# EAGLE design lamloei_breadout_a07201 (EAGLE 7.7.0)
CNAME: LamLoei breadout A07201; CREVISION: R1; DESIGNER: lamloei co.,ltd.
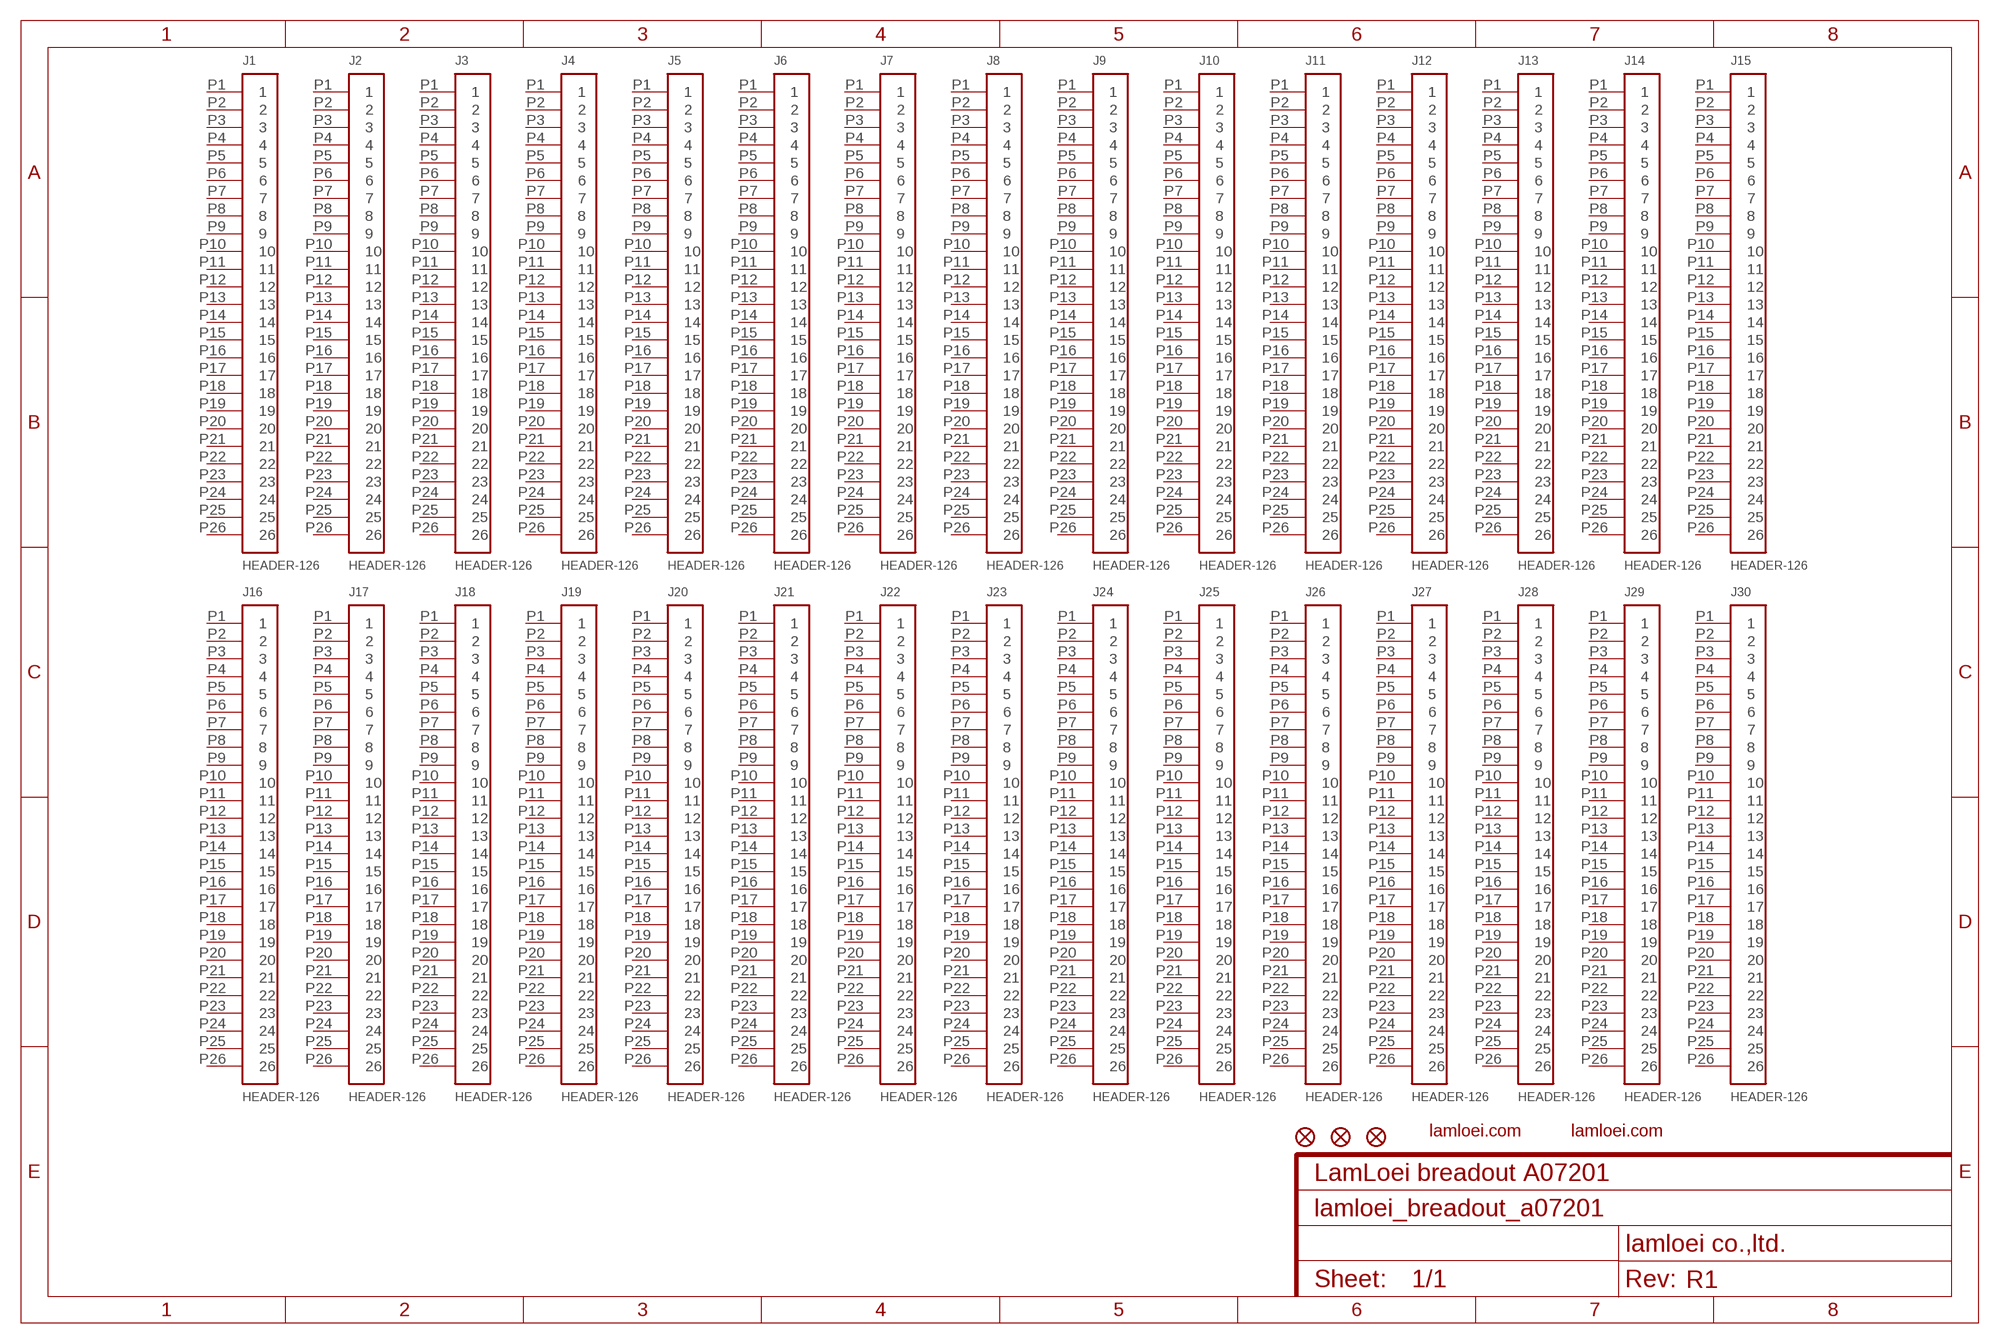
[diagram p0: schematic, sheet 1]

## Parts
J1  HEADER-126  [HEADER-126]
J2  HEADER-126  [HEADER-126]
J3  HEADER-126  [HEADER-126]
J4  HEADER-126  [HEADER-126]
J5  HEADER-126  [HEADER-126]
J6  HEADER-126  [HEADER-126]
J7  HEADER-126  [HEADER-126]
J8  HEADER-126  [HEADER-126]
J9  HEADER-126  [HEADER-126]
J10  HEADER-126  [HEADER-126]
J11  HEADER-126  [HEADER-126]
J12  HEADER-126  [HEADER-126]
J13  HEADER-126  [HEADER-126]
J14  HEADER-126  [HEADER-126]
J15  HEADER-126  [HEADER-126]
J16  HEADER-126  [HEADER-126]
J17  HEADER-126  [HEADER-126]
J18  HEADER-126  [HEADER-126]
J19  HEADER-126  [HEADER-126]
J20  HEADER-126  [HEADER-126]
J21  HEADER-126  [HEADER-126]
J22  HEADER-126  [HEADER-126]
J23  HEADER-126  [HEADER-126]
J24  HEADER-126  [HEADER-126]
J25  HEADER-126  [HEADER-126]
J26  HEADER-126  [HEADER-126]
J27  HEADER-126  [HEADER-126]
J28  HEADER-126  [HEADER-126]
J29  HEADER-126  [HEADER-126]
J30  HEADER-126  [HEADER-126]
ZFD1  FIDUCIAL1X2  [FIDUCIAL-1X2]
ZFD2  FIDUCIAL1X2  [FIDUCIAL-1X2]
ZFD3  FIDUCIAL1X2  [FIDUCIAL-1X2]
ZL1  LAMLEOI_LOGO_3  [LAMLEOI_LOGO_3]
ZL2  LAMLEOI_LOGO_3  [LAMLEOI_LOGO_3]
Unconnected: J1.P1 J1.P2 J1.P3 J1.P4 J1.P5 J1.P6 J1.P7 J1.P8 J1.P9 J1.P10 J1.P11 J1.P12 J1.P13 J1.P14 J1.P15 J1.P16 J1.P17 J1.P18 J1.P19 J1.P20 J1.P21 J1.P22 J1.P23 J1.P24 J1.P25 J1.P26 J2.P1 J2.P2 J2.P3 J2.P4 J2.P5 J2.P6 J2.P7 J2.P8 J2.P9 J2.P10 J2.P11 J2.P12 J2.P13 J2.P14 J2.P15 J2.P16 J2.P17 J2.P18 J2.P19 J2.P20 J2.P21 J2.P22 J2.P23 J2.P24 J2.P25 J2.P26 J3.P1 J3.P2 J3.P3 J3.P4 J3.P5 J3.P6 J3.P7 J3.P8 J3.P9 J3.P10 J3.P11 J3.P12 J3.P13 J3.P14 J3.P15 J3.P16 J3.P17 J3.P18 J3.P19 J3.P20 J3.P21 J3.P22 J3.P23 J3.P24 J3.P25 J3.P26 J4.P1 J4.P2 J4.P3 J4.P4 J4.P5 J4.P6 J4.P7 J4.P8 J4.P9 J4.P10 J4.P11 J4.P12 J4.P13 J4.P14 J4.P15 J4.P16 J4.P17 J4.P18 J4.P19 J4.P20 J4.P21 J4.P22 J4.P23 J4.P24 J4.P25 J4.P26 J5.P1 J5.P2 J5.P3 J5.P4 J5.P5 J5.P6 J5.P7 J5.P8 J5.P9 J5.P10 J5.P11 J5.P12 J5.P13 J5.P14 J5.P15 J5.P16 J5.P17 J5.P18 J5.P19 J5.P20 J5.P21 J5.P22 J5.P23 J5.P24 J5.P25 J5.P26 J6.P1 J6.P2 J6.P3 J6.P4 J6.P5 J6.P6 J6.P7 J6.P8 J6.P9 J6.P10 J6.P11 J6.P12 J6.P13 J6.P14 J6.P15 J6.P16 J6.P17 J6.P18 J6.P19 J6.P20 J6.P21 J6.P22 J6.P23 J6.P24 J6.P25 J6.P26 J7.P1 J7.P2 J7.P3 J7.P4 J7.P5 J7.P6 J7.P7 J7.P8 J7.P9 J7.P10 J7.P11 J7.P12 J7.P13 J7.P14 J7.P15 J7.P16 J7.P17 J7.P18 J7.P19 J7.P20 J7.P21 J7.P22 J7.P23 J7.P24 J7.P25 J7.P26 J8.P1 J8.P2 J8.P3 J8.P4 J8.P5 J8.P6 J8.P7 J8.P8 J8.P9 J8.P10 J8.P11 J8.P12 J8.P13 J8.P14 J8.P15 J8.P16 J8.P17 J8.P18 J8.P19 J8.P20 J8.P21 J8.P22 J8.P23 J8.P24 J8.P25 J8.P26 J9.P1 J9.P2 J9.P3 J9.P4 J9.P5 J9.P6 J9.P7 J9.P8 J9.P9 J9.P10 J9.P11 J9.P12 J9.P13 J9.P14 J9.P15 J9.P16 J9.P17 J9.P18 J9.P19 J9.P20 J9.P21 J9.P22 J9.P23 J9.P24 J9.P25 J9.P26 J10.P1 J10.P2 J10.P3 J10.P4 J10.P5 J10.P6 J10.P7 J10.P8 J10.P9 J10.P10 J10.P11 J10.P12 J10.P13 J10.P14 J10.P15 J10.P16 J10.P17 J10.P18 J10.P19 J10.P20 J10.P21 J10.P22 J10.P23 J10.P24 J10.P25 J10.P26 J11.P1 J11.P2 J11.P3 J11.P4 J11.P5 J11.P6 J11.P7 J11.P8 J11.P9 J11.P10 J11.P11 J11.P12 J11.P13 J11.P14 J11.P15 J11.P16 J11.P17 J11.P18 J11.P19 J11.P20 J11.P21 J11.P22 J11.P23 J11.P24 J11.P25 J11.P26 J12.P1 J12.P2 J12.P3 J12.P4 J12.P5 J12.P6 J12.P7 J12.P8 J12.P9 J12.P10 J12.P11 J12.P12 J12.P13 J12.P14 J12.P15 J12.P16 J12.P17 J12.P18 J12.P19 J12.P20 J12.P21 J12.P22 J12.P23 J12.P24 J12.P25 J12.P26 J13.P1 J13.P2 J13.P3 J13.P4 J13.P5 J13.P6 J13.P7 J13.P8 J13.P9 J13.P10 J13.P11 J13.P12 J13.P13 J13.P14 J13.P15 J13.P16 J13.P17 J13.P18 J13.P19 J13.P20 J13.P21 J13.P22 J13.P23 J13.P24 J13.P25 J13.P26 J14.P1 J14.P2 J14.P3 J14.P4 J14.P5 J14.P6 J14.P7 J14.P8 J14.P9 J14.P10 J14.P11 J14.P12 J14.P13 J14.P14 J14.P15 J14.P16 J14.P17 J14.P18 J14.P19 J14.P20 J14.P21 J14.P22 J14.P23 J14.P24 J14.P25 J14.P26 J15.P1 J15.P2 J15.P3 J15.P4 J15.P5 J15.P6 J15.P7 J15.P8 J15.P9 J15.P10 J15.P11 J15.P12 J15.P13 J15.P14 J15.P15 J15.P16 J15.P17 J15.P18 J15.P19 J15.P20 J15.P21 J15.P22 J15.P23 J15.P24 J15.P25 J15.P26 J16.P1 J16.P2 J16.P3 J16.P4 J16.P5 J16.P6 J16.P7 J16.P8 J16.P9 J16.P10 J16.P11 J16.P12 J16.P13 J16.P14 J16.P15 J16.P16 J16.P17 J16.P18 J16.P19 J16.P20 J16.P21 J16.P22 J16.P23 J16.P24 J16.P25 J16.P26 J17.P1 J17.P2 J17.P3 J17.P4 J17.P5 J17.P6 J17.P7 J17.P8 J17.P9 J17.P10 J17.P11 J17.P12 J17.P13 J17.P14 J17.P15 J17.P16 J17.P17 J17.P18 J17.P19 J17.P20 J17.P21 J17.P22 J17.P23 J17.P24 J17.P25 J17.P26 J18.P1 J18.P2 J18.P3 J18.P4 J18.P5 J18.P6 J18.P7 J18.P8 J18.P9 J18.P10 J18.P11 J18.P12 J18.P13 J18.P14 J18.P15 J18.P16 J18.P17 J18.P18 J18.P19 J18.P20 J18.P21 J18.P22 J18.P23 J18.P24 J18.P25 J18.P26 J19.P1 J19.P2 J19.P3 J19.P4 J19.P5 J19.P6 J19.P7 J19.P8 J19.P9 J19.P10 J19.P11 J19.P12 J19.P13 J19.P14 J19.P15 J19.P16 J19.P17 J19.P18 J19.P19 J19.P20 J19.P21 J19.P22 J19.P23 J19.P24 J19.P25 J19.P26 J20.P1 J20.P2 J20.P3 J20.P4 J20.P5 J20.P6 J20.P7 J20.P8 J20.P9 J20.P10 J20.P11 J20.P12 J20.P13 J20.P14 J20.P15 J20.P16 J20.P17 J20.P18 J20.P19 J20.P20 J20.P21 J20.P22 J20.P23 J20.P24 J20.P25 J20.P26 J21.P1 J21.P2 J21.P3 J21.P4 J21.P5 J21.P6 J21.P7 J21.P8 J21.P9 J21.P10 J21.P11 J21.P12 J21.P13 J21.P14 J21.P15 J21.P16 J21.P17 J21.P18 J21.P19 J21.P20 J21.P21 J21.P22 J21.P23 J21.P24 J21.P25 J21.P26 J22.P1 J22.P2 J22.P3 J22.P4 J22.P5 J22.P6 J22.P7 J22.P8 J22.P9 J22.P10 J22.P11 J22.P12 J22.P13 J22.P14 J22.P15 J22.P16 J22.P17 J22.P18 J22.P19 J22.P20 J22.P21 J22.P22 J22.P23 J22.P24 J22.P25 J22.P26 J23.P1 J23.P2 J23.P3 J23.P4 J23.P5 J23.P6 J23.P7 J23.P8 J23.P9 J23.P10 J23.P11 J23.P12 J23.P13 J23.P14 J23.P15 J23.P16 J23.P17 J23.P18 J23.P19 J23.P20 J23.P21 J23.P22 J23.P23 J23.P24 J23.P25 J23.P26 J24.P1 J24.P2 J24.P3 J24.P4 J24.P5 J24.P6 J24.P7 J24.P8 J24.P9 J24.P10 J24.P11 J24.P12 J24.P13 J24.P14 J24.P15 J24.P16 J24.P17 J24.P18 J24.P19 J24.P20 J24.P21 J24.P22 J24.P23 J24.P24 J24.P25 J24.P26 J25.P1 J25.P2 J25.P3 J25.P4 J25.P5 J25.P6 J25.P7 J25.P8 J25.P9 J25.P10 J25.P11 J25.P12 J25.P13 J25.P14 J25.P15 J25.P16 J25.P17 J25.P18 J25.P19 J25.P20 J25.P21 J25.P22 J25.P23 J25.P24 J25.P25 J25.P26 J26.P1 J26.P2 J26.P3 J26.P4 J26.P5 J26.P6 J26.P7 J26.P8 J26.P9 J26.P10 J26.P11 J26.P12 J26.P13 J26.P14 J26.P15 J26.P16 J26.P17 J26.P18 J26.P19 J26.P20 J26.P21 J26.P22 J26.P23 J26.P24 J26.P25 J26.P26 J27.P1 J27.P2 J27.P3 J27.P4 J27.P5 J27.P6 J27.P7 J27.P8 J27.P9 J27.P10 J27.P11 J27.P12 J27.P13 J27.P14 J27.P15 J27.P16 J27.P17 J27.P18 J27.P19 J27.P20 J27.P21 J27.P22 J27.P23 J27.P24 J27.P25 J27.P26 J28.P1 J28.P2 J28.P3 J28.P4 J28.P5 J28.P6 J28.P7 J28.P8 J28.P9 J28.P10 J28.P11 J28.P12 J28.P13 J28.P14 J28.P15 J28.P16 J28.P17 J28.P18 J28.P19 J28.P20 J28.P21 J28.P22 J28.P23 J28.P24 J28.P25 J28.P26 J29.P1 J29.P2 J29.P3 J29.P4 J29.P5 J29.P6 J29.P7 J29.P8 J29.P9 J29.P10 J29.P11 J29.P12 J29.P13 J29.P14 J29.P15 J29.P16 J29.P17 J29.P18 J29.P19 J29.P20 J29.P21 J29.P22 J29.P23 J29.P24 J29.P25 J29.P26 J30.P1 J30.P2 J30.P3 J30.P4 J30.P5 J30.P6 J30.P7 J30.P8 J30.P9 J30.P10 J30.P11 J30.P12 J30.P13 J30.P14 J30.P15 J30.P16 J30.P17 J30.P18 J30.P19 J30.P20 J30.P21 J30.P22 J30.P23 J30.P24 J30.P25 J30.P26

## Library data of the parts
J1-J30 = lamloei_e77_HEADER-126B:HEADER-126
ZFD1-ZFD3 = SparkFun-Aesthetics:FIDUCIAL: Fiducial Alignment Points Point-of-reference for pick-and-place machines and other optical instruments.
ZL1 ZL2 = lamloei_logo_3:LAMLEOI_LOGO_3: lamloei

## Board
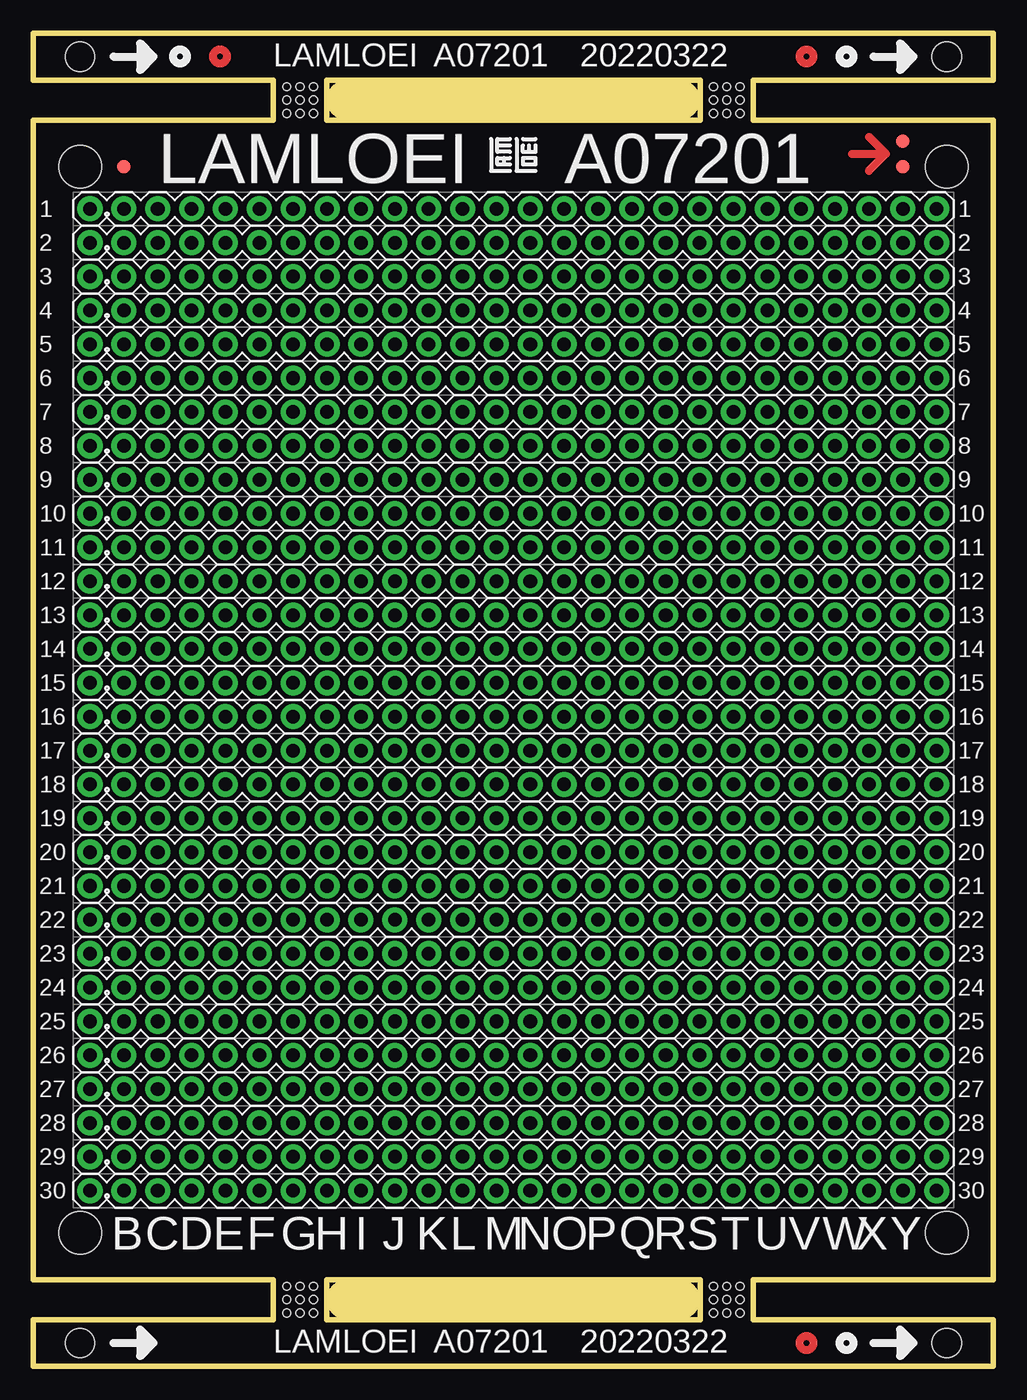
[diagram p1: board, top side]
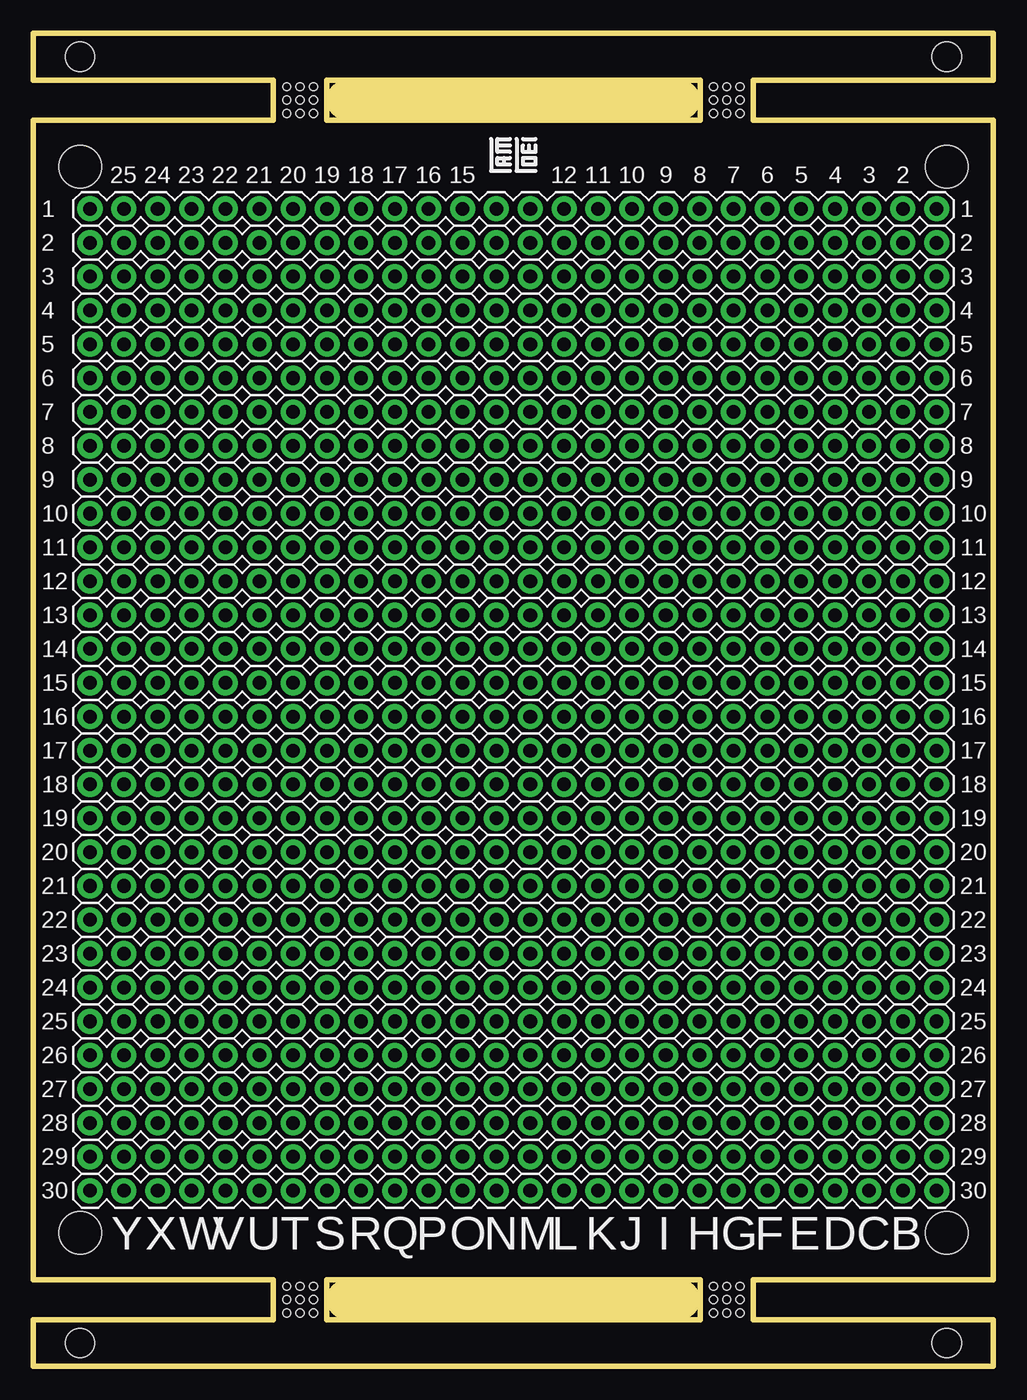
[diagram p2: board, bottom side, seen from below]

Size 72 x 100 mm. Coordinates in mm from the lower left corner, seen from the top.
Outline: 0,93.5 18,93.5 18,96.5 0,96.5 0,100 72,100 72,96.5 54,96.5 54,93.5 72,93.5 72,6.5 54,6.5 54,3.5 72,3.5 72,0 0,0 0,3.5 18,3.5 18,6.5 0,6.5 0,93.5
Outline: 22,93.5 50,93.5 50,96.5 22,96.5 22,93.5
Outline: 50,6.5 22,6.5 22,3.5 50,3.5 50,6.5
Copper layers (1*16): Top 0.035mm / dielectric 0.2mm / Bottom 0.035mm
Design rules "jlcpcb-2-layer": minimum track width 3.5mil, minimum drill 0.2mm, track to track 3.5mil, track to pad 5mil, pad to pad 5mil, via to via 5mil, smd to smd 0mil, copper to edge 0.1mm, drill to drill 5mil, minimum pad ring 4mil, minimum via ring 4mil, stop-mask expansion 3mil, vias tented up to drill 100mil, thermal gap 10mil
Holes 3.2 mm at 3.5,10 68.5,10 3.5,90 68.5,90
Holes 0.6 mm at 19,6 20,6 21,6 19,5 19,4 20,5 20,4 21,5 21,4 53,6 52,6 51,6 51,5 52,5 53,5 53,4 52,4 51,4 19,94 20,94 21,94 21,95 21,96 20,96 20,95 19,95 19,96 53,94 52,94 51,94 51,95 52,95 53,95 53,96 52,96 51,96
Holes 2.2 mm at 3.5,1.75 68.5,1.75 68.5,98.25 3.5,98.25
Milling: 2 lines

### Footprints (pad centres in the part's own frame; a part is rotated, then mirrored left to right if it is on the bottom)
HEADER-126 = drill 1.016 pad 1.88: P1 31.75,0; P2 29.21,0; P3 26.67,0; P4 24.13,0; P5 21.59,0; P6 19.05,0; P7 16.51,0; P8 13.97,0; P9 11.43,0; P10 8.89,0; P11 6.35,0; P12 3.81,0; P13 1.27,0; P14 -1.27,0; P15 -3.81,0; P16 -6.35,0; P17 -8.89,0; P18 -11.43,0; P19 -13.97,0; P20 -16.51,0; P21 -19.05,0; P22 -21.59,0; P23 -24.13,0; P24 -26.67,0; P25 -29.21,0; P26 -31.75,0
FIDUCIAL-1X2 = smd 1 x 1: 1 0,0

### Placement (x,y rotation side)
J1  36,86.83 180 top
J2  36,84.29 180 top
J3  36,81.75 180 top
J4  36,79.21 180 top
J5  36,76.67 180 top
J6  36,74.13 180 top
J7  36,71.59 180 top
J8  36,69.05 180 top
J9  36,66.51 180 top
J10  36,63.97 180 top
J11  36,61.43 180 top
J12  36,58.89 180 top
J13  36,56.35 180 top
J14  36,53.81 180 top
J15  36,51.27 180 top
J16  36,48.73 180 top
J17  36,46.19 180 top
J18  36,43.65 180 top
J19  36,41.11 180 top
J20  36,38.57 180 top
J21  36,36.03 180 top
J22  36,33.49 180 top
J23  36,30.95 180 top
J24  36,28.41 180 top
J25  36,25.87 180 top
J26  36,23.33 180 top
J27  36,20.79 180 top
J28  36,18.25 180 top
J29  36,15.71 180 top
J30  36,13.17 180 top
ZFD1  6.79,90 0 top
ZFD2  65.21,91.91 0 top
ZFD3  65.21,90 0 top
ZL1  34.02,89.37 0 top
ZL2  37.98,89.37 0 bottom

### Tracks (layer width: path | path; a pad name or v marks a point on that pad's centre or on a via)
N$1
  Top 0.61: 61.4,90.96 63.94,90.96 | 63.94,90.96 62.67,92.23 | 62.67,89.69 63.94,90.96
(copper drawn outside any net)
  shapes: Top circle x3

### Text on the board
tNames: LAMLOEI | A07201 | 20220322 | LAMLOEI | A07201 | 1 | 1 | 2 | 2 | 3 | 3 | 4 | 4 | 5 | 5 | 6 | 6 | 7 | 7 | 8 | 8 | 9 | 9 | 10 | 10 | 11 | 11 | 12 | 12 | 13 | 13 | 14 | 14 | 15 | 15 | 16 | 16 | 17 | 17 | 18 | 18 | 19 | 19 | 20 | 20 | 21 | 21 | 22 | 22 | 23 | 23 | 24 | 24 | 25 | 25 | 26 | 26 | 27 | 27 | 28 | 28 | 29 | 29 | 30 | 30 | B | C | D | E | F | G | H | I | J | K | L | M | N | O | P | Q | R | S | T | U | V | W | X | Y | LAMLOEI | A07201 | 20220322
bNames: 2 | 3 | 4 | 5 | 6 | 7 | 8 | 9 | 10 | 11 | 12 | 15 | 16 | 17 | 18 | 19 | 20 | 21 | 22 | 23 | 24 | 25 | 1 | 1 | 2 | 2 | 3 | 3 | 4 | 4 | 5 | 5 | 6 | 6 | 7 | 7 | 8 | 8 | 9 | 9 | 10 | 10 | 11 | 11 | 12 | 12 | 13 | 13 | 14 | 14 | 15 | 15 | 16 | 16 | 17 | 17 | 18 | 18 | 19 | 19 | 20 | 20 | 21 | 21 | 22 | 22 | 23 | 23 | 24 | 24 | 25 | 25 | 26 | 26 | 27 | 27 | 28 | 28 | 29 | 29 | 30 | 30 | B | C | D | E | F | G | H | I | J | K | L | M | N | O | P | Q | R | S | T | U | V | W | X | Y